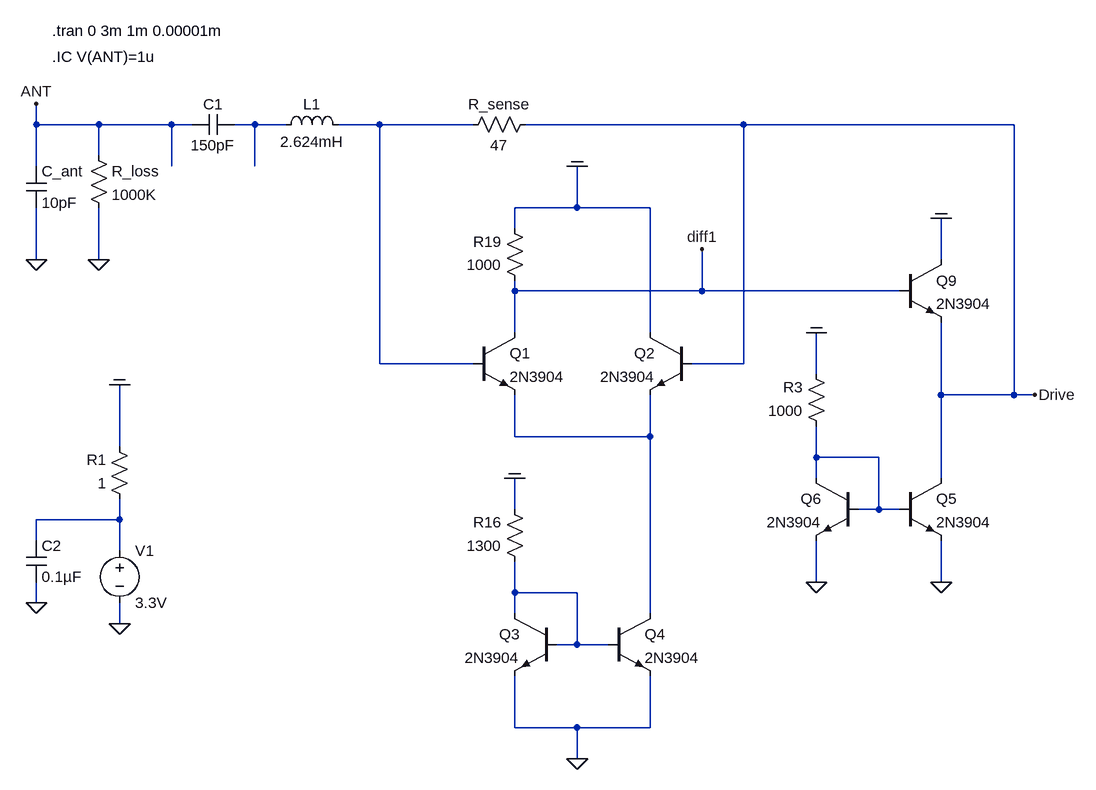
[diagram p0: schematic 2020_current_sense_comparator_npn_v04.asc]
2020_current_sense_comparator_npn_v04.asc, the LTspice schematic file:
Version 4
SHEET 1 3920 3748
WIRE -832 480 -832 448
WIRE -736 480 -832 480
WIRE -624 480 -736 480
WIRE -592 480 -624 480
WIRE -496 480 -528 480
WIRE -448 480 -496 480
WIRE -304 480 -368 480
WIRE -160 480 -304 480
WIRE 256 480 -80 480
WIRE 672 480 256 480
WIRE -736 528 -736 480
WIRE -832 544 -832 480
WIRE -624 544 -624 480
WIRE -496 544 -496 480
WIRE 0 608 0 544
WIRE 0 608 -96 608
WIRE 112 608 0 608
WIRE -96 640 -96 608
WIRE -832 688 -832 608
WIRE -736 688 -736 608
WIRE 560 688 560 624
WIRE -96 736 -96 720
WIRE 192 736 192 672
WIRE 192 736 -96 736
WIRE 496 736 192 736
WIRE -96 800 -96 736
WIRE 112 800 112 608
WIRE -304 848 -304 480
WIRE -160 848 -304 848
WIRE 256 848 256 480
WIRE 256 848 176 848
WIRE 368 864 368 800
WIRE 560 896 560 784
WIRE 672 896 672 480
WIRE 672 896 560 896
WIRE 704 896 672 896
WIRE -96 960 -96 896
WIRE 112 960 112 896
WIRE 112 960 -96 960
WIRE -704 976 -704 880
WIRE 368 992 368 944
WIRE 464 992 368 992
WIRE 368 1024 368 992
WIRE 560 1024 560 896
WIRE -96 1072 -96 1024
WIRE 464 1072 464 992
WIRE 464 1072 432 1072
WIRE 496 1072 464 1072
WIRE -704 1088 -704 1056
WIRE -704 1088 -832 1088
WIRE -832 1120 -832 1088
WIRE -704 1136 -704 1088
WIRE 368 1184 368 1120
WIRE 560 1184 560 1120
WIRE -96 1200 -96 1152
WIRE 0 1200 -96 1200
WIRE -832 1216 -832 1184
WIRE -96 1232 -96 1200
WIRE 112 1232 112 960
WIRE -704 1248 -704 1216
WIRE 0 1280 0 1200
WIRE 0 1280 -32 1280
WIRE 48 1280 0 1280
WIRE -96 1408 -96 1328
WIRE 0 1408 -96 1408
WIRE 112 1408 112 1328
WIRE 112 1408 0 1408
WIRE 0 1456 0 1408
FLAG -704 1248 0
FLAG -704 880 COM
FLAG -832 688 0
FLAG -832 448 ANT
FLAG -736 688 0
FLAG 0 1456 0
FLAG 0 544 COM
FLAG -96 1024 COM
FLAG 560 624 COM
FLAG 704 896 Drive
FLAG 192 672 diff1
FLAG -832 1216 0
FLAG 560 1184 0
FLAG 368 800 COM
FLAG 368 1184 0
SYMBOL voltage -704 1120 R0
WINDOW 123 0 0 Left 0
WINDOW 39 0 0 Left 0
SYMATTR InstName V1
SYMATTR Value 3.3V
SYMBOL ind -464 496 R270
WINDOW 0 32 56 VTop 2
WINDOW 3 5 56 VBottom 2
SYMATTR InstName L1
SYMATTR Value 2.624mH
SYMATTR SpiceLine Rser=66 Rpar=10Meg Cpar=1.216pF
SYMBOL cap -848 544 R0
SYMATTR InstName C_ant
SYMATTR Value 10pF
SYMBOL res -752 512 R0
SYMATTR InstName R_loss
SYMATTR Value 1000K
SYMBOL res -64 464 R90
WINDOW 0 0 56 VBottom 2
WINDOW 3 32 56 VTop 2
SYMATTR InstName R_sense
SYMATTR Value 47
SYMBOL npn -160 800 R0
SYMATTR InstName Q1
SYMATTR Value 2N3904
SYMBOL npn 176 800 M0
SYMATTR InstName Q2
SYMATTR Value 2N3904
SYMBOL npn -32 1232 M0
SYMATTR InstName Q3
SYMATTR Value 2N3904
SYMBOL npn 48 1232 R0
SYMATTR InstName Q4
SYMATTR Value 2N3904
SYMBOL res -80 1168 R180
WINDOW 0 36 76 Left 2
WINDOW 3 36 40 Left 2
SYMATTR InstName R16
SYMATTR Value 1300
SYMBOL res -80 736 R180
WINDOW 0 36 76 Left 2
WINDOW 3 36 40 Left 2
SYMATTR InstName R19
SYMATTR Value 1000
SYMBOL npn 496 688 R0
SYMATTR InstName Q9
SYMATTR Value 2N3904
SYMBOL res -688 1072 R180
WINDOW 0 36 76 Left 2
WINDOW 3 36 40 Left 2
SYMATTR InstName R1
SYMATTR Value 1
SYMBOL cap -848 1120 R0
SYMATTR InstName C2
SYMATTR Value 0.1µF
SYMBOL npn 496 1024 R0
SYMATTR InstName Q5
SYMATTR Value 2N3904
SYMBOL cap -528 464 R90
WINDOW 0 0 32 VBottom 2
WINDOW 3 32 32 VTop 2
SYMATTR InstName C1
SYMATTR Value 150pF
SYMBOL npn 432 1024 M0
SYMATTR InstName Q6
SYMATTR Value 2N3904
SYMBOL res 384 960 R180
WINDOW 0 36 76 Left 2
WINDOW 3 36 40 Left 2
SYMATTR InstName R3
SYMATTR Value 1000
TEXT -808 336 Left 2 !.tran 0 3m 1m 0.00001m
TEXT -808 376 Left 2 !.IC V(ANT)=1u

The netlist it stands for:
* 2020_current_sense_comparator_npn_v04.asc
V1 N005 0 3.3V
L1 N001 N002 2.624mH Rser=66 Rpar=10Meg Cpar=1.216pF
C_ant ANT 0 10pF
R_loss ANT 0 1000K
R_sense Drive N002 47
Q1 diff1 N002 N003 0 2N3904
Q2 COM Drive N003 0 2N3904
Q3 N006 N006 0 0 2N3904
Q4 N003 N006 0 0 2N3904
R16 N006 COM 1300
R19 diff1 COM 1000
Q9 COM diff1 Drive 0 2N3904
R1 N005 COM 1
C2 N005 0 0.1µF
Q5 Drive N004 0 0 2N3904
C1 N001 ANT 150pF
Q6 N004 N004 0 0 2N3904
R3 N004 COM 1000
.model NPN NPN
.model PNP PNP
.lib standard.bjt
.tran 0 3m 1m 0.00001m
.IC V(ANT)=1u
.backanno
.end